# Altium schematic sheet Non-Isolated Interface.SchDoc
size 420 x 297 mm; SheetNumber: 1; SheetTotal: 1
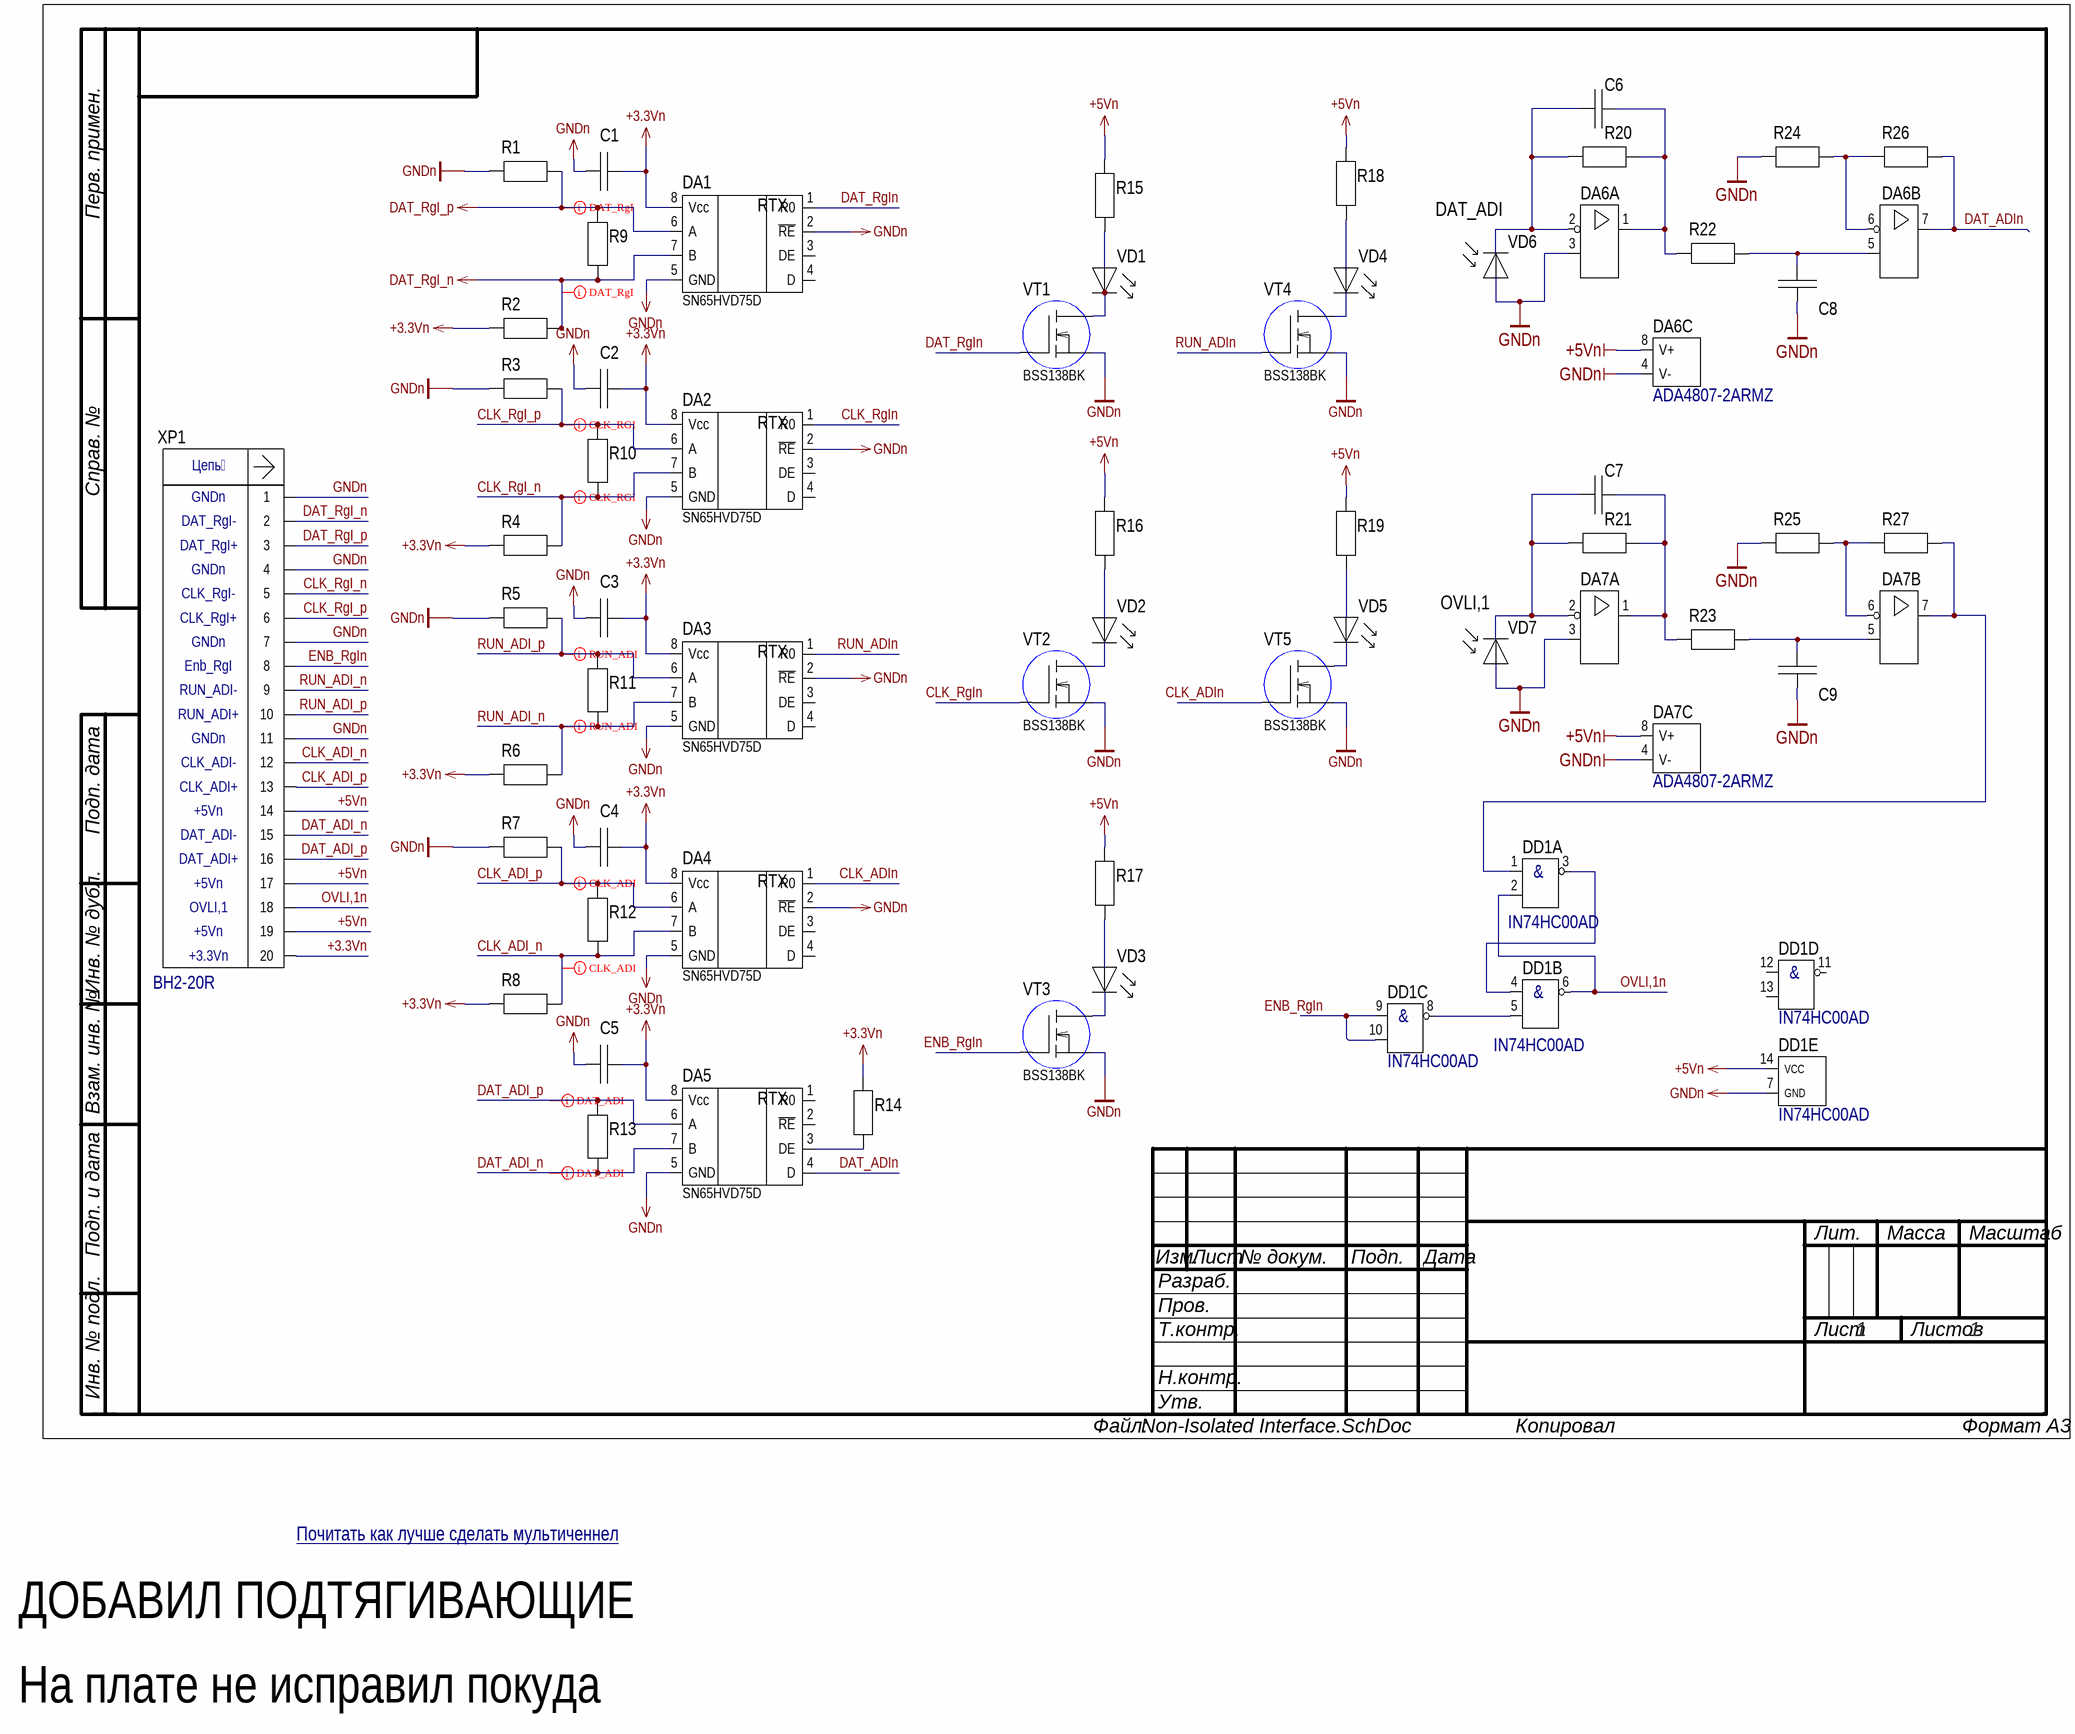
[diagram p0: Non-Isolated Interface.SchDoc]

## Parts
C1  0805-X7R-25 В-0,1 мкФ +-10%  [CAP: 0805]  (value not drawn)
C2  0805-X7R-25 В-0,1 мкФ +-10%  [CAP: 0805]  (value not drawn)
C3  0805-X7R-25 В-0,1 мкФ +-10%  [CAP: 0805]  (value not drawn)
C4  0805-X7R-25 В-0,1 мкФ +-10%  [CAP: 0805]  (value not drawn)
C5  0805-X7R-25 В-0,1 мкФ +-10%  [CAP: 0805]  (value not drawn)
C6  0805-NP0-50 В-2,4 пФ-1%  [CAP: 0805]  (value not drawn)
C7  0805-NP0-50 В-2,4 пФ-1%  [CAP: 0805]  (value not drawn)
C8  1206-С0G-50 B-56 пФ+-1%  [CAP: 1206]  (value not drawn)
C9  1206-С0G-50 B-56 пФ+-1%  [CAP: 1206]  (value not drawn)
DA1  SN65HVD75D  [8-SOIC]
DA2  SN65HVD75D  [8-SOIC]
DA3  SN65HVD75D  [8-SOIC]
DA4  SN65HVD75D  [8-SOIC]
DA5  SN65HVD75D  [8-SOIC]
DA6  ADA4807-2ARMZ  [8-MSOP]  (value not drawn)  (parts A,B,C of 3)
DA7  ADA4807-2ARMZ  [8-MSOP]  (value not drawn)  (parts A,B,C of 3)
DD1  IN74HC00AD  [14-soic]  (parts A,B,C,D,E of 5)
R1  1206-1 кОм+-5%  [1206]  (value not drawn)
R2  1206-1 кОм+-5%  [1206]  (value not drawn)
R3  1206-1 кОм+-5%  [1206]  (value not drawn)
R4  1206-1 кОм+-5%  [1206]  (value not drawn)
R5  1206-1 кОм+-5%  [1206]  (value not drawn)
R6  1206-1 кОм+-5%  [1206]  (value not drawn)
R7  1206-1 кОм+-5%  [1206]  (value not drawn)
R8  1206-1 кОм+-5%  [1206]  (value not drawn)
R9  1206-100 Ом+-5%  [1206]  (value not drawn)
R10  1206-100 Ом+-5%  [1206]  (value not drawn)
R11  1206-100 Ом+-5%  [1206]  (value not drawn)
R12  1206-100 Ом+-5%  [1206]  (value not drawn)
R13  1206-100 Ом+-5%  [1206]  (value not drawn)
R14  0805-10 KОМ+-5%  [0805]  (value not drawn)
R15  1206-30 Ом+-5%  [1206]  (value not drawn)
R16  1206-30 Ом+-5%  [1206]  (value not drawn)
R17  1206-30 Ом+-5%  [1206]  (value not drawn)
R18  1206-30 Ом+-5%  [1206]  (value not drawn)
R19  1206-30 Ом+-5%  [1206]  (value not drawn)
R20  1206-5,23 кОм+-1%  [1206]  (value not drawn)
R21  1206-5,23 кОм+-1%  [1206]  (value not drawn)
R22  1206-140 Ом+-1%  [1206]  (value not drawn)
R23  1206-140 Ом+-1%  [1206]  (value not drawn)
R24  1206-102 Ом+-1%  [1206]  (value not drawn)
R25  1206-102 Ом+-1%  [1206]  (value not drawn)
R26  1206-215 Ом+-1%  [1206]  (value not drawn)
R27  1206-215 Ом+-1%  [1206]  (value not drawn)
VD1  VSMY2853RG  [VSMY2853G]  (value not drawn)
VD2  VSMY2853RG  [VSMY2853G]  (value not drawn)
VD3  VSMY2853RG  [VSMY2853G]  (value not drawn)
VD4  VSMY2853RG  [VSMY2853G]  (value not drawn)
VD5  VSMY2853RG  [VSMY2853G]  (value not drawn)
VD6  SFH203  [SFH203]  (value not drawn)
VD7  SFH203  [SFH203]  (value not drawn)
VT1  BSS138BK  [SOT-23-3]
VT2  BSS138BK  [SOT-23-3]
VT3  BSS138BK  [SOT-23-3]
VT4  BSS138BK  [SOT-23-3]
VT5  BSS138BK  [SOT-23-3]
XP1  BH2-20R  [BH2-20R]

## Nets
+3.3Vn: C1.2 C2.2 C3.2 C4.2 C5.2 DA1.8(Vcc) DA2.8(Vcc) DA3.8(Vcc) DA4.8(Vcc) DA5.8(Vcc) R2.1 R4.2 R6.2 R8.2 R14.2 XP1.20
+5Vn: DA6.8(V+) DA7.8(V+) DD1.14(VCC) R15.2 R16.2 R17.2 R18.2 R19.2 XP1.14 XP1.17 XP1.19
DAT_RgI_n: DA1.7(B) R2.2 R9.1 XP1.2
DAT_RgI_p: DA1.6(A) R1.2 R9.2 XP1.3
GNDn: C1.1 C2.1 C3.1 C4.1 C5.1 C8.1 C9.1 DA1.2(~{RE}) DA1.5(GND) DA2.2(~{RE}) DA2.5(GND) DA3.2(~{RE}) DA3.5(GND) DA4.2(~{RE}) DA4.5(GND) DA5.5(GND) DA6.3(+IN_A) DA6.4(V-) DA7.3(+IN_A) DA7.4(V-) DD1.7(GND) R1.1 R3.1 R5.2 R7.1 R24.1 R25.1 VD6.1 VD7.1 VT1.2(S) VT2.2(S) VT3.2(S) VT4.2(S) VT5.2(S) XP1.1 XP1.4 XP1.7 XP1.11
CLK_ADI_n: DA4.7(B) R8.1 R12.1 XP1.12
CLK_ADI_p: DA4.6(A) R7.2 R12.2 XP1.13
CLK_ADIn: DA4.1(R0) VT5.1(G)
CLK_RgI_n: DA2.7(B) R4.1 R10.1 XP1.5
CLK_RgI_p: DA2.6(A) R3.2 R10.2 XP1.6
CLK_RgIn: DA2.1(R0) VT2.1(G)
DAT_ADI_n: DA5.7(B) R13.1 XP1.15
DAT_ADI_p: DA5.6(A) R13.2 XP1.16
DAT_ADIn: DA5.4(D) DA6.7(OUT_B) R26.2
DAT_RgIn: DA1.1(R0) VT1.1(G)
ENB_RgIn: DD1.9(A3) DD1.10(B3) VT3.1(G) XP1.8
OVLI,1n: DD1.2(B1) DD1.6(Y2) XP1.18
RUN_ADI_n: DA3.7(B) R6.1 R11.1 XP1.9
RUN_ADI_p: DA3.6(A) R5.1 R11.2 XP1.10
RUN_ADIn: DA3.1(R0) VT4.1(G)
NetC6_1: C6.1 DA6.2(-IN_A) R20.1 VD6.2
NetC6_2: C6.2 DA6.1(OUT_A) R20.2 R22.1
NetC7_1: C7.1 DA7.2(-IN_A) R21.1 VD7.2
NetC7_2: C7.2 DA7.1(OUT_A) R21.2 R23.1
NetC8_2: C8.2 DA6.5(+IN_B) R22.2
NetC9_2: C9.2 DA7.5(+IN_B) R23.2
NetDA5_3: DA5.3(DE) R14.1
NetDA6_6: DA6.6(-IN_B) R24.2 R26.1
NetDA7_6: DA7.6(-IN_B) R25.2 R27.1
NetDA7_7: DA7.7(OUT_B) DD1.1(A1) R27.2
NetDD1_3: DD1.3(Y1) DD1.4(A2)
NetDD1_5: DD1.5(B2) DD1.8(Y3)
NetR15_1: R15.1 VD1.1(Anode)
NetR16_1: R16.1 VD2.1(Anode)
NetR17_1: R17.1 VD3.1(Anode)
NetR18_1: R18.1 VD4.1(Anode)
NetR19_1: R19.1 VD5.1(Anode)
NetVD1_2: VD1.2(Cathode) VT1.3(D)
NetVD2_2: VD2.2(Cathode) VT2.3(D)
NetVD3_2: VD3.2(Cathode) VT3.3(D)
NetVD4_2: VD4.2(Cathode) VT4.3(D)
NetVD5_2: VD5.2(Cathode) VT5.3(D)

Not connected (* = marked no-connect by the designer): DA1 3(DE) 4(D); DA2 3(DE) 4(D); DA3 3(DE) 4(D); DA4 3(DE) 4(D); DA5 1(R0) 2(~{RE}); DD1 11(Y4) 12(A4) 13(B4)

## Layout directives
differential pair: CLK_ADI_n, CLK_ADI_p, CLK_RgI_n, CLK_RgI_p, DAT_ADI_n, DAT_ADI_p, DAT_RgI_n, DAT_RgI_p, RUN_ADI_n, RUN_ADI_p

## Notes on the sheet
- (near VD6) DAT_ADI
- GNDn
- (near XP1) DAT_RgI-
- (near XP1) DAT_RgI+
- (near XP1) 1
- (near XP1) 2
- (near XP1) 3
- (near XP1) CLK_RgI-
- (near XP1) 4
- (near XP1) 5
- (near XP1) Enb_RgI
- (near XP1) CLK_RgI+
- (near XP1) 6
- (near XP1) 7
- (near XP1) 8
- (near VD7) OVLI,1
- (near XP1) RUN_ADI-
- (near XP1) RUN_ADI+
- (near XP1) 9
- (near XP1) 10
- (near XP1) CLK_ADI-
- (near XP1) CLK_ADI+
- (near XP1) 11
- (near XP1) 12
- (near XP1) 13
- +5Vn
- (near XP1) DAT_ADI-
- (near XP1) 14
- (near XP1) 15
- (near XP1) DAT_ADI+
- OVLI,1
- (near XP1) 16
- (near XP1) 17
- (near XP1) 18
- +3.3Vn
- (near XP1) 19
- (near XP1) 20
- Почитать как лучше сделать мультиченнел <https://www.altium.com/ru/documentation/altium-designer/schematic/creating-multi-channel-design?srsltid=AfmBOoowIIgC5oni57reNHnMsLt-gKogXpLBYmzkREkKA0Q0dj4Nk9HQ#ae8f2b5cea890581aea85b89c941a49c>
- ДОБАВИЛ ПОДТЯГИВАЮЩИЕ
- На плате не исправил покуда
- Перв. примен.
- Справ. №
- Подп. дата
- Инв. № дубл.
- Взам. инв. №
- Подп. и дата
- Изм.
- Разраб.
- Лист
- № докум.
- Подп.
- Дата
- Лит.
- Масса
- Масштаб
- Пров.
- Т.контр.
- Листов
- Инв. № подл.
- Н.контр.
- Утв.
- ALTIUM GOSTBOM2.0 KEV
- Файл:
- Копировал
- Формат А3
- (in symbol BH2-20R) Цепь
- (in symbol IN74HC00AD, part A) &
- (in symbol IN74HC00AD, part B) &
- (in symbol IN74HC00AD, part C) &
- (in symbol IN74HC00AD, part D) &
- (in symbol SN65HVD75D) RTX

## Library data of the parts
C1-C5 = 0805-X7R-25 В-0,1 мкФ +-10%: Value: 0,1 мкФ
C6 C7 = 0805-NP0-50 В-2,4 пФ-1%: Value: 2,1 мкФ
C8 C9 = 1206-С0G-50 B-56 пФ+-1%: Value: 56 пФ
DA6 DA7 = ADA4807-2ARMZ: 3.1 nV/√Hz, 1 mA, 180 MHz, / Rail-to-Rail Input/Output Amplifiers
DD1 = IN74HC00AD: Quad 2-Input NAND Gate High-Performance Silicon-Gate CMOS.
R1-R8 = 1206-1 кОм+-5%: Value: 1 кОм; ModelPrint: 1206
R9-R13 = 1206-100 Ом+-5%: Value: 100 Ом; ModelPrint: 1206
R14 = 0805-10 KОМ+-5%: Value: 10 кОм; ModelPrint: 0805
R15-R19 = 1206-30 Ом+-5%: Value: 30 Ом; ModelPrint: 1206
R22 R23 = 1206-140 Ом+-1%: Value: 140 Ом; ModelPrint: 1206
R24 R25 = 1206-102 Ом+-1%: Value: 102 Ом; ModelPrint: 1206
R26 R27 = 1206-215 Ом+-1%: Value: 215 Ом; ModelPrint: 1206
VD1-VD5 = VSMY2853RG: High Speed Infrared Emitting Diodes, 850 nm, / Surface Emitter Technology
VD6 VD7 = SFH203: Silicon PIN Photodiode
VT1-VT5 = BSS138BK: 60 V, 360 mA N-channel Trench MOSFET
XP1 = BH2-20R: pitch 2mm, 20 pin 2x10
R20 R21 = 1206-5,23 кОм+-1%: ModelPrint: 1206; Value: 5,23 кОм